# Altium schematic sheet Sensor_Array_Large.SchDoc
size C
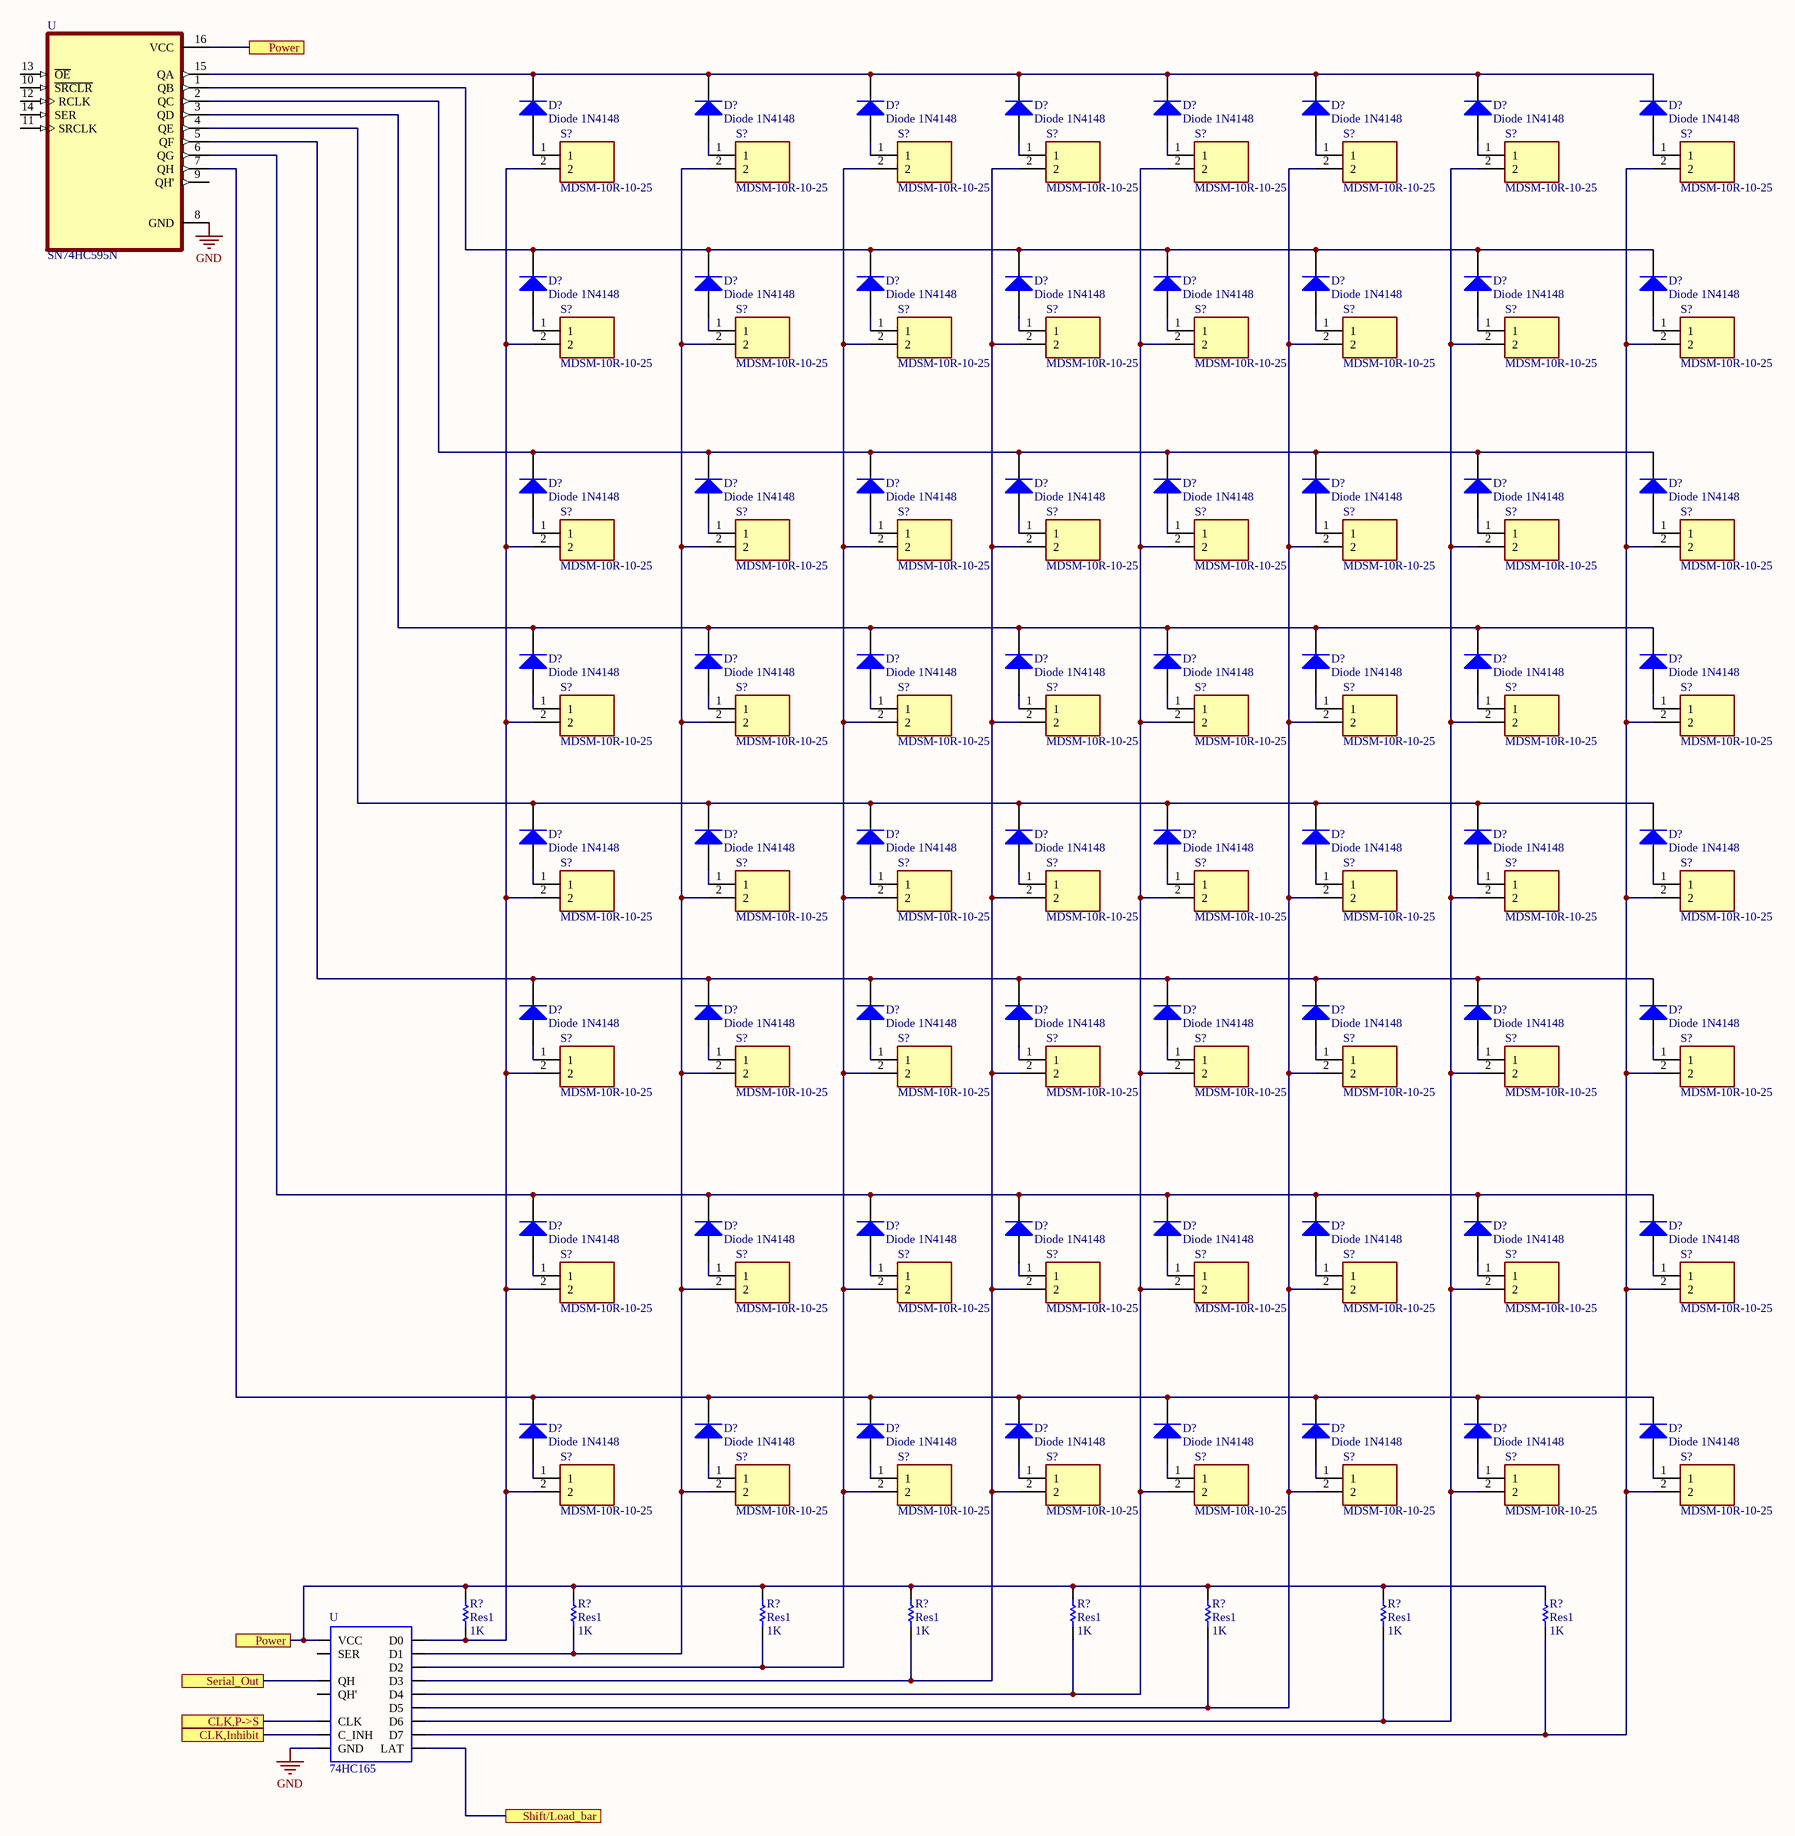
[diagram p0: Sensor_Array_Large.SchDoc]

## Parts
(Parts that share a designator on the sheet are numbered #1, #2 ... from top to bottom, then left to right.)
D?#1  Diode 1N4148  [DO-35]
D?#2  Diode 1N4148  [DO-35]
D?#3  Diode 1N4148  [DO-35]
D?#4  Diode 1N4148  [DO-35]
D?#5  Diode 1N4148  [DO-35]
D?#6  Diode 1N4148  [DO-35]
D?#7  Diode 1N4148  [DO-35]
D?#8  Diode 1N4148  [DO-35]
D?#9  Diode 1N4148  [DO-35]
D?#10  Diode 1N4148  [DO-35]
D?#11  Diode 1N4148  [DO-35]
D?#12  Diode 1N4148  [DO-35]
D?#13  Diode 1N4148  [DO-35]
D?#14  Diode 1N4148  [DO-35]
D?#15  Diode 1N4148  [DO-35]
D?#16  Diode 1N4148  [DO-35]
D?#17  Diode 1N4148  [DO-35]
D?#18  Diode 1N4148  [DO-35]
D?#19  Diode 1N4148  [DO-35]
D?#20  Diode 1N4148  [DO-35]
D?#21  Diode 1N4148  [DO-35]
D?#22  Diode 1N4148  [DO-35]
D?#23  Diode 1N4148  [DO-35]
D?#24  Diode 1N4148  [DO-35]
D?#25  Diode 1N4148  [DO-35]
D?#26  Diode 1N4148  [DO-35]
D?#27  Diode 1N4148  [DO-35]
D?#28  Diode 1N4148  [DO-35]
D?#29  Diode 1N4148  [DO-35]
D?#30  Diode 1N4148  [DO-35]
D?#31  Diode 1N4148  [DO-35]
D?#32  Diode 1N4148  [DO-35]
D?#33  Diode 1N4148  [DO-35]
D?#34  Diode 1N4148  [DO-35]
D?#35  Diode 1N4148  [DO-35]
D?#36  Diode 1N4148  [DO-35]
D?#37  Diode 1N4148  [DO-35]
D?#38  Diode 1N4148  [DO-35]
D?#39  Diode 1N4148  [DO-35]
D?#40  Diode 1N4148  [DO-35]
D?#41  Diode 1N4148  [DO-35]
D?#42  Diode 1N4148  [DO-35]
D?#43  Diode 1N4148  [DO-35]
D?#44  Diode 1N4148  [DO-35]
D?#45  Diode 1N4148  [DO-35]
D?#46  Diode 1N4148  [DO-35]
D?#47  Diode 1N4148  [DO-35]
D?#48  Diode 1N4148  [DO-35]
D?#49  Diode 1N4148  [DO-35]
D?#50  Diode 1N4148  [DO-35]
D?#51  Diode 1N4148  [DO-35]
D?#52  Diode 1N4148  [DO-35]
D?#53  Diode 1N4148  [DO-35]
D?#54  Diode 1N4148  [DO-35]
D?#55  Diode 1N4148  [DO-35]
D?#56  Diode 1N4148  [DO-35]
D?#57  Diode 1N4148  [DO-35]
D?#58  Diode 1N4148  [DO-35]
D?#59  Diode 1N4148  [DO-35]
D?#60  Diode 1N4148  [DO-35]
D?#61  Diode 1N4148  [DO-35]
D?#62  Diode 1N4148  [DO-35]
D?#63  Diode 1N4148  [DO-35]
D?#64  Diode 1N4148  [DO-35]
R?#1  Res1  value 1K  [AXIAL-0.3]
R?#2  Res1  value 1K  [AXIAL-0.3]
R?#3  Res1  value 1K  [AXIAL-0.3]
R?#4  Res1  value 1K  [AXIAL-0.3]
R?#5  Res1  value 1K  [AXIAL-0.3]
R?#6  Res1  value 1K  [AXIAL-0.3]
R?#7  Res1  value 1K  [AXIAL-0.3]
R?#8  Res1  value 1K  [AXIAL-0.3]
S?#1  MDSM-10R-10-25  [MDSM10R1025]
S?#2  MDSM-10R-10-25  [MDSM10R1025]
S?#3  MDSM-10R-10-25  [MDSM10R1025]
S?#4  MDSM-10R-10-25  [MDSM10R1025]
S?#5  MDSM-10R-10-25  [MDSM10R1025]
S?#6  MDSM-10R-10-25  [MDSM10R1025]
S?#7  MDSM-10R-10-25  [MDSM10R1025]
S?#8  MDSM-10R-10-25  [MDSM10R1025]
S?#9  MDSM-10R-10-25  [MDSM10R1025]
S?#10  MDSM-10R-10-25  [MDSM10R1025]
S?#11  MDSM-10R-10-25  [MDSM10R1025]
S?#12  MDSM-10R-10-25  [MDSM10R1025]
S?#13  MDSM-10R-10-25  [MDSM10R1025]
S?#14  MDSM-10R-10-25  [MDSM10R1025]
S?#15  MDSM-10R-10-25  [MDSM10R1025]
S?#16  MDSM-10R-10-25  [MDSM10R1025]
S?#17  MDSM-10R-10-25  [MDSM10R1025]
S?#18  MDSM-10R-10-25  [MDSM10R1025]
S?#19  MDSM-10R-10-25  [MDSM10R1025]
S?#20  MDSM-10R-10-25  [MDSM10R1025]
S?#21  MDSM-10R-10-25  [MDSM10R1025]
S?#22  MDSM-10R-10-25  [MDSM10R1025]
S?#23  MDSM-10R-10-25  [MDSM10R1025]
S?#24  MDSM-10R-10-25  [MDSM10R1025]
S?#25  MDSM-10R-10-25  [MDSM10R1025]
S?#26  MDSM-10R-10-25  [MDSM10R1025]
S?#27  MDSM-10R-10-25  [MDSM10R1025]
S?#28  MDSM-10R-10-25  [MDSM10R1025]
S?#29  MDSM-10R-10-25  [MDSM10R1025]
S?#30  MDSM-10R-10-25  [MDSM10R1025]
S?#31  MDSM-10R-10-25  [MDSM10R1025]
S?#32  MDSM-10R-10-25  [MDSM10R1025]
S?#33  MDSM-10R-10-25  [MDSM10R1025]
S?#34  MDSM-10R-10-25  [MDSM10R1025]
S?#35  MDSM-10R-10-25  [MDSM10R1025]
S?#36  MDSM-10R-10-25  [MDSM10R1025]
S?#37  MDSM-10R-10-25  [MDSM10R1025]
S?#38  MDSM-10R-10-25  [MDSM10R1025]
S?#39  MDSM-10R-10-25  [MDSM10R1025]
S?#40  MDSM-10R-10-25  [MDSM10R1025]
S?#41  MDSM-10R-10-25  [MDSM10R1025]
S?#42  MDSM-10R-10-25  [MDSM10R1025]
S?#43  MDSM-10R-10-25  [MDSM10R1025]
S?#44  MDSM-10R-10-25  [MDSM10R1025]
S?#45  MDSM-10R-10-25  [MDSM10R1025]
S?#46  MDSM-10R-10-25  [MDSM10R1025]
S?#47  MDSM-10R-10-25  [MDSM10R1025]
S?#48  MDSM-10R-10-25  [MDSM10R1025]
S?#49  MDSM-10R-10-25  [MDSM10R1025]
S?#50  MDSM-10R-10-25  [MDSM10R1025]
S?#51  MDSM-10R-10-25  [MDSM10R1025]
S?#52  MDSM-10R-10-25  [MDSM10R1025]
S?#53  MDSM-10R-10-25  [MDSM10R1025]
S?#54  MDSM-10R-10-25  [MDSM10R1025]
S?#55  MDSM-10R-10-25  [MDSM10R1025]
S?#56  MDSM-10R-10-25  [MDSM10R1025]
S?#57  MDSM-10R-10-25  [MDSM10R1025]
S?#58  MDSM-10R-10-25  [MDSM10R1025]
S?#59  MDSM-10R-10-25  [MDSM10R1025]
S?#60  MDSM-10R-10-25  [MDSM10R1025]
S?#61  MDSM-10R-10-25  [MDSM10R1025]
S?#62  MDSM-10R-10-25  [MDSM10R1025]
S?#63  MDSM-10R-10-25  [MDSM10R1025]
S?#64  MDSM-10R-10-25  [MDSM10R1025]
U#1  SN74HC595N  [DIP794W45P254L1969H508Q16]
U#2  74HC165  [SO-16]

## Ports
CLK,Inhibit, CLK,P->S, Power, Serial_Out, Shift/Load_bar

## Nets
GND: U#1.8(GND) U#2.8(GND)
CLK,Inhibit: U#2.15(C_INH) ; port CLK,Inhibit
CLK,P->S: U#2.2(CLK) ; port CLK,P->S
Power: R?#1.2 R?#2.2 R?#3.2 R?#4.2 R?#5.2 R?#6.2 R?#7.2 R?#8.2 U#1.16(VCC) U#2.16(VCC) ; port Power
Serial_Out: U#2.9(QH) ; port Serial_Out
Shift/Load_bar: U#2.1(LAT) ; port Shift/Load_bar
NetD?#1_1: D?#1.1(A) S?#1.1
NetD?#1_2: D?#1.2(K) D?#2.2(K) D?#3.2(K) D?#4.2(K) D?#5.2(K) D?#6.2(K) D?#7.2(K) D?#8.2(K) U#1.15(QA)
NetD?#2_1: D?#2.1(A) S?#2.1
NetD?#3_1: D?#3.1(A) S?#3.1
NetD?#4_1: D?#4.1(A) S?#4.1
NetD?#5_1: D?#5.1(A) S?#5.1
NetD?#6_1: D?#6.1(A) S?#6.1
NetD?#7_1: D?#7.1(A) S?#7.1
NetD?#8_1: D?#8.1(A) S?#8.1
NetD?#9_1: D?#9.1(A) S?#9.1
NetD?#9_2: D?#9.2(K) D?#10.2(K) D?#11.2(K) D?#12.2(K) D?#13.2(K) D?#14.2(K) D?#15.2(K) D?#16.2(K) U#1.1(QB)
NetD?#10_1: D?#10.1(A) S?#10.1
NetD?#11_1: D?#11.1(A) S?#11.1
NetD?#12_1: D?#12.1(A) S?#12.1
NetD?#13_1: D?#13.1(A) S?#13.1
NetD?#14_1: D?#14.1(A) S?#14.1
NetD?#15_1: D?#15.1(A) S?#15.1
NetD?#16_1: D?#16.1(A) S?#16.1
NetD?#17_1: D?#17.1(A) S?#17.1
NetD?#17_2: D?#17.2(K) D?#18.2(K) D?#19.2(K) D?#20.2(K) D?#21.2(K) D?#22.2(K) D?#23.2(K) D?#24.2(K) U#1.2(QC)
NetD?#18_1: D?#18.1(A) S?#18.1
NetD?#19_1: D?#19.1(A) S?#19.1
NetD?#20_1: D?#20.1(A) S?#20.1
NetD?#21_1: D?#21.1(A) S?#21.1
NetD?#22_1: D?#22.1(A) S?#22.1
NetD?#23_1: D?#23.1(A) S?#23.1
NetD?#24_1: D?#24.1(A) S?#24.1
NetD?#25_1: D?#25.1(A) S?#25.1
NetD?#25_2: D?#25.2(K) D?#26.2(K) D?#27.2(K) D?#28.2(K) D?#29.2(K) D?#30.2(K) D?#31.2(K) D?#32.2(K) U#1.3(QD)
NetD?#26_1: D?#26.1(A) S?#26.1
NetD?#27_1: D?#27.1(A) S?#27.1
NetD?#28_1: D?#28.1(A) S?#28.1
NetD?#29_1: D?#29.1(A) S?#29.1
NetD?#30_1: D?#30.1(A) S?#30.1
NetD?#31_1: D?#31.1(A) S?#31.1
NetD?#32_1: D?#32.1(A) S?#32.1
NetD?#33_1: D?#33.1(A) S?#33.1
NetD?#33_2: D?#33.2(K) D?#34.2(K) D?#35.2(K) D?#36.2(K) D?#37.2(K) D?#38.2(K) D?#39.2(K) D?#40.2(K) U#1.4(QE)
NetD?#34_1: D?#34.1(A) S?#34.1
NetD?#35_1: D?#35.1(A) S?#35.1
NetD?#36_1: D?#36.1(A) S?#36.1
NetD?#37_1: D?#37.1(A) S?#37.1
NetD?#38_1: D?#38.1(A) S?#38.1
NetD?#39_1: D?#39.1(A) S?#39.1
NetD?#40_1: D?#40.1(A) S?#40.1
NetD?#41_1: D?#41.1(A) S?#41.1
NetD?#41_2: D?#41.2(K) D?#42.2(K) D?#43.2(K) D?#44.2(K) D?#45.2(K) D?#46.2(K) D?#47.2(K) D?#48.2(K) U#1.5(QF)
NetD?#42_1: D?#42.1(A) S?#42.1
NetD?#43_1: D?#43.1(A) S?#43.1
NetD?#44_1: D?#44.1(A) S?#44.1
NetD?#45_1: D?#45.1(A) S?#45.1
NetD?#46_1: D?#46.1(A) S?#46.1
NetD?#47_1: D?#47.1(A) S?#47.1
NetD?#48_1: D?#48.1(A) S?#48.1
NetD?#49_1: D?#49.1(A) S?#49.1
NetD?#49_2: D?#49.2(K) D?#50.2(K) D?#51.2(K) D?#52.2(K) D?#53.2(K) D?#54.2(K) D?#55.2(K) D?#56.2(K) U#1.6(QG)
NetD?#50_1: D?#50.1(A) S?#50.1
NetD?#51_1: D?#51.1(A) S?#51.1
NetD?#52_1: D?#52.1(A) S?#52.1
NetD?#53_1: D?#53.1(A) S?#53.1
NetD?#54_1: D?#54.1(A) S?#54.1
NetD?#55_1: D?#55.1(A) S?#55.1
NetD?#56_1: D?#56.1(A) S?#56.1
NetD?#57_1: D?#57.1(A) S?#57.1
NetD?#57_2: D?#57.2(K) D?#58.2(K) D?#59.2(K) D?#60.2(K) D?#61.2(K) D?#62.2(K) D?#63.2(K) D?#64.2(K) U#1.7(QH)
NetD?#58_1: D?#58.1(A) S?#58.1
NetD?#59_1: D?#59.1(A) S?#59.1
NetD?#60_1: D?#60.1(A) S?#60.1
NetD?#61_1: D?#61.1(A) S?#61.1
NetD?#62_1: D?#62.1(A) S?#62.1
NetD?#63_1: D?#63.1(A) S?#63.1
NetD?#64_1: D?#64.1(A) S?#64.1
NetR?#1_1: R?#1.1 S?#1.2 S?#9.2 S?#17.2 S?#25.2 S?#33.2 S?#41.2 S?#49.2 S?#57.2 U#2.11(D0)
NetR?#2_1: R?#2.1 S?#2.2 S?#10.2 S?#18.2 S?#26.2 S?#34.2 S?#42.2 S?#50.2 S?#58.2 U#2.12(D1)
NetR?#3_1: R?#3.1 S?#3.2 S?#11.2 S?#19.2 S?#27.2 S?#35.2 S?#43.2 S?#51.2 S?#59.2 U#2.13(D2)
NetR?#4_1: R?#4.1 S?#4.2 S?#12.2 S?#20.2 S?#28.2 S?#36.2 S?#44.2 S?#52.2 S?#60.2 U#2.14(D3)
NetR?#5_1: R?#5.1 S?#5.2 S?#13.2 S?#21.2 S?#29.2 S?#37.2 S?#45.2 S?#53.2 S?#61.2 U#2.3(D4)
NetR?#6_1: R?#6.1 S?#6.2 S?#14.2 S?#22.2 S?#30.2 S?#38.2 S?#46.2 S?#54.2 S?#62.2 U#2.4(D5)
NetR?#7_1: R?#7.1 S?#7.2 S?#15.2 S?#23.2 S?#31.2 S?#39.2 S?#47.2 S?#55.2 S?#63.2 U#2.5(D6)
NetR?#8_1: R?#8.1 S?#8.2 S?#16.2 S?#24.2 S?#32.2 S?#40.2 S?#48.2 S?#56.2 S?#64.2 U#2.6(D7)

Not connected (* = marked no-connect by the designer): U#1 9(QH') 10(~{SRCLR}) 11(SRCLK) 12(RCLK) 13(~{OE}) 14(SER); U#2 7(QH') 10(SER)

## Library data of the parts
D?#1-D?#64 = Diode 1N4148: High Conductance Fast Diode; Published: 8-Jun-2000; LatestRevisionDate: 17-Jul-2002; LatestRevisionNote: Re-released for DXP Platform.; DatasheetVersion: 1997; PackageReference: DO-35; Publisher: Altium Limited; PackageDescription: Diode, Axial; Body 3.8 x 1.9 mm (LxDia. max), Lead Dia. 0.53 mm (max); Code_JEDEC: DO-204-AH; ComponentLink1Description: Manufacturer Link; ComponentLink1URL: http://www.fairchildsemi.com/; ComponentLink2Description: Datasheet; ComponentLink2URL: http://www.fairchildsemi.com/ds/1N%2F1N4148.pdf
R?#1-R?#8 = Res1: Resistor; Published: 8-Jun-2000; LatestRevisionDate: 17-Jul-2002; LatestRevisionNote: Re-released for DXP Platform.; PackageReference: AXIAL-0.3; Publisher: Altium Limited; PackageDescription: Axial Device, Thru-Hole; 2 Leads; 0.3 in Pin Spacing
S?#1-S?#64 = MDSM-10R-10-25: Switch; Manufacturer_Name: LITTELFUSE; Description: Magnetic / Reed Switches SWITCH REED; Datasheet Link: https://www.littelfuse.com/~/media/electronics/datasheets/reed_switches/littelfuse_reed_switches_mdsm_10_datasheet.pdf.pdf; Height: 2mm; Manufacturer_Part_Number: MDSM-10R-10-25; Mouser Part Number: 934-MDSM-10R10-25; Mouser Price/Stock: https://www.mouser.co.uk/ProductDetail/Littelfuse/MDSM-10R-10-25?qs=nyo4TFax6Nce6Y4AmbWmcw%3D%3D; Arrow Part Number: MDSM-10R-10-25; Arrow Price/Stock: https://www.arrow.com/en/products/mdsm-10r-10-25/littelfuse
U#1 = SN74HC595N: 8-bit shift registers with 3-state output registers 16-PDIP -40 to 85; MF: Texas Instruments; MP: SN74HC595N; Price: None; Package: PDIP-16 Texas Instruments; Texas_Instruments-Purchase-URL: https://snapeda.com/shop?store=Texas+Instruments&id=2479486; Value: *; Availability: Unavailable; SnapEDA_Link: https://www.snapeda.com/parts/SN74HC595N/Texas%20Instruments/view-part/2479486/?ref=snap
U#2 = 74HC165: Shift Shift Register 1 Element 8 Bit 16-SO; MF: Nexperia USA; SnapEDA_Link: https://www.snapeda.com/parts/74HC165/Nexperia%20USA%20Inc./view-part/560686/?ref=snap; Availability: Unavailable; Price: None; Package: VFQFN-16 STMicroelectronics; MP: 74HC165; Value: *